# EAGLE design blynk_light_switch_v1 (EAGLE 7.6.0)
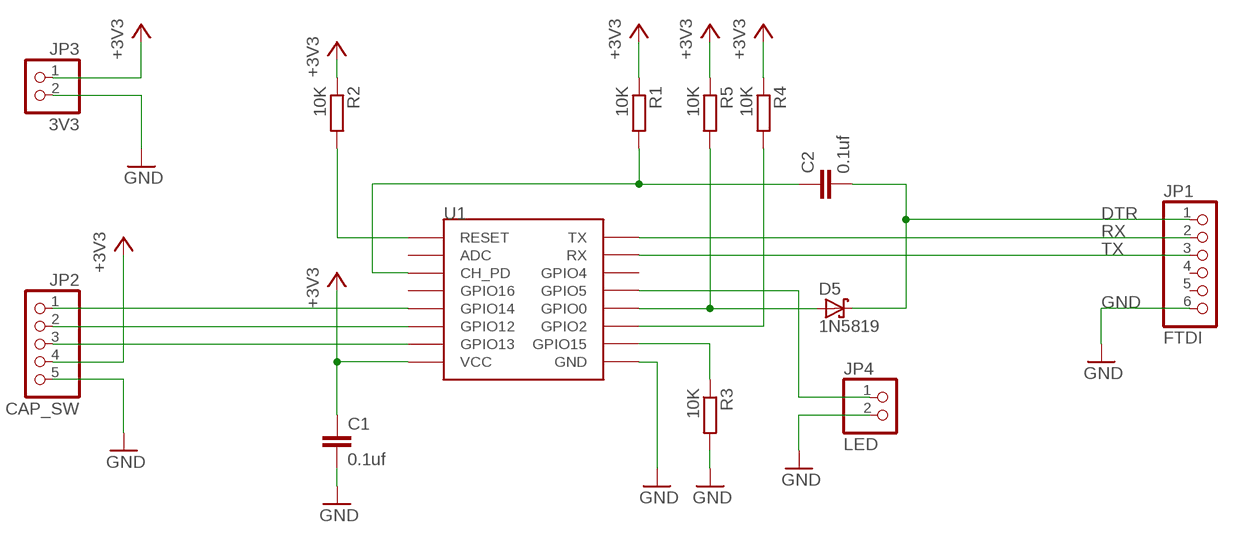
[diagram p0: schematic, sheet 1]

## Parts
C1  0.1uf  C-EUC0805  [C0805]
C2  0.1uf  C-EUC0805  [C0805]
D5  1N5819  SCHOTTKY-DIODECB429-17  [CB429-17]
JP1  FTDI  PINHD-1X6  [1X06]
JP2  CAP_SW  PINHD-1X5  [1X05]
JP3  3V3  PINHD-1X2  [1X02]
JP4  LED  PINHD-1X2  [1X02]
R1  10K  R-EU_R0805  [R0805]
R2  10K  R-EU_R0805  [R0805]
R3  10K  R-EU_R0805  [R0805]
R4  10K  R-EU_R0805  [R0805]
R5  10K  R-EU_R0805  [R0805]
U1  ESP12SMD  [ESP12-SMD]

## Nets
+3V3: C1.1 JP2.4 JP3.1 R1.1 R2.1 R4.1 R5.1 U1.VCC
DTR: C2.2 D5.C JP1.1
GND: C1.2 JP1.6 JP2.5 JP3.2 JP4.2 R3.2 U1.GND
N$1: R2.2 U1.RESET
N$2: C2.1 R1.2 U1.CH_PD
N$4: R4.2 U1.GPIO2
N$5: JP2.1 U1.GPIO14
N$6: D5.A R5.2 U1.GPIO0
N$7: JP2.2 U1.GPIO12
N$8: JP2.3 U1.GPIO13
N$9: R3.1 U1.GPIO15
N$10: JP4.1 U1.GPIO5
RX: JP1.2 U1.TXD0(TX)
TX: JP1.3 U1.RXD0(RX)
Unconnected: JP1.4 JP1.5 U1.ADC U1.GPIO4 U1.GPIO16

## Library data of the parts
C1 C2 = resistor:C-EU: CAPACITOR, European symbol
D5 = diode:SCHOTTKY-DIODE: Schottky Diode
JP1 = adafruit:PINHD-1X6: PIN HEADER; OC_FARNELL: unknown
JP2 = pinhead:PINHD-1X5: PIN HEADER
JP3 JP4 = pinhead:PINHD-1X2: PIN HEADER
R1-R5 = resistor:R-EU_: RESISTOR, European symbol; MF: ARCOL/OHMITE; MPN: MRA0207 100K B 15PPM TA; OC_FARNELL: 2531019
U1 = esp8266modules:ESP12: ESP8266 Wifi module 12; OC_FARNELL: unknown

## Net classes
0 default: width 0.305 mm, drill 0.508 mm, clearance 0.254 mm

## Board
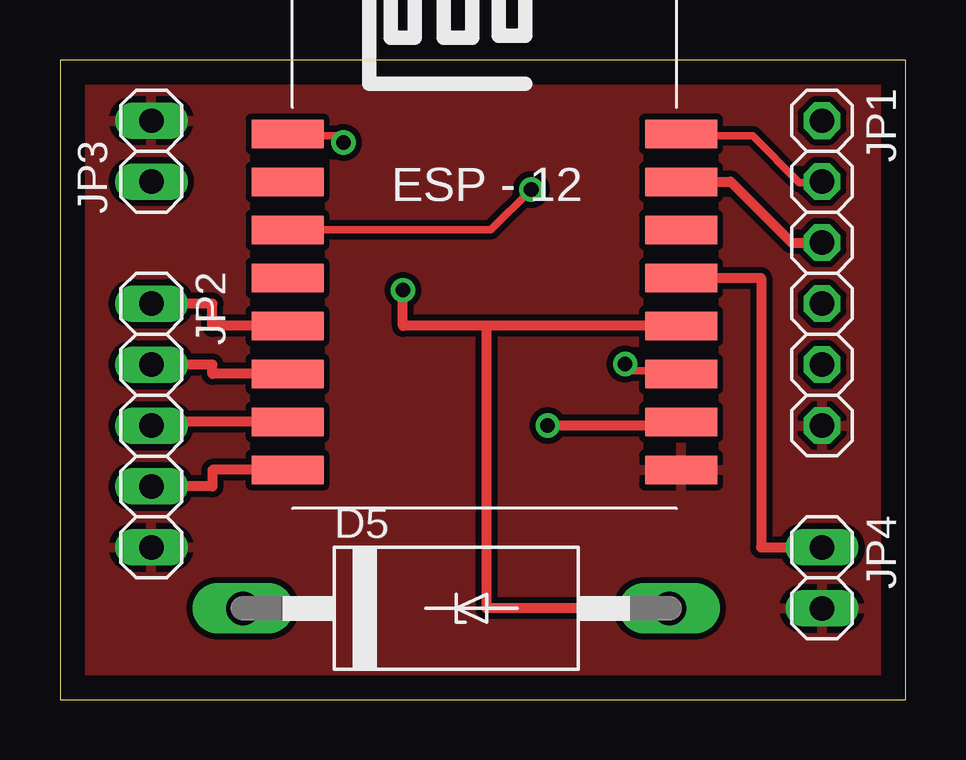
[diagram p1: board, top side]
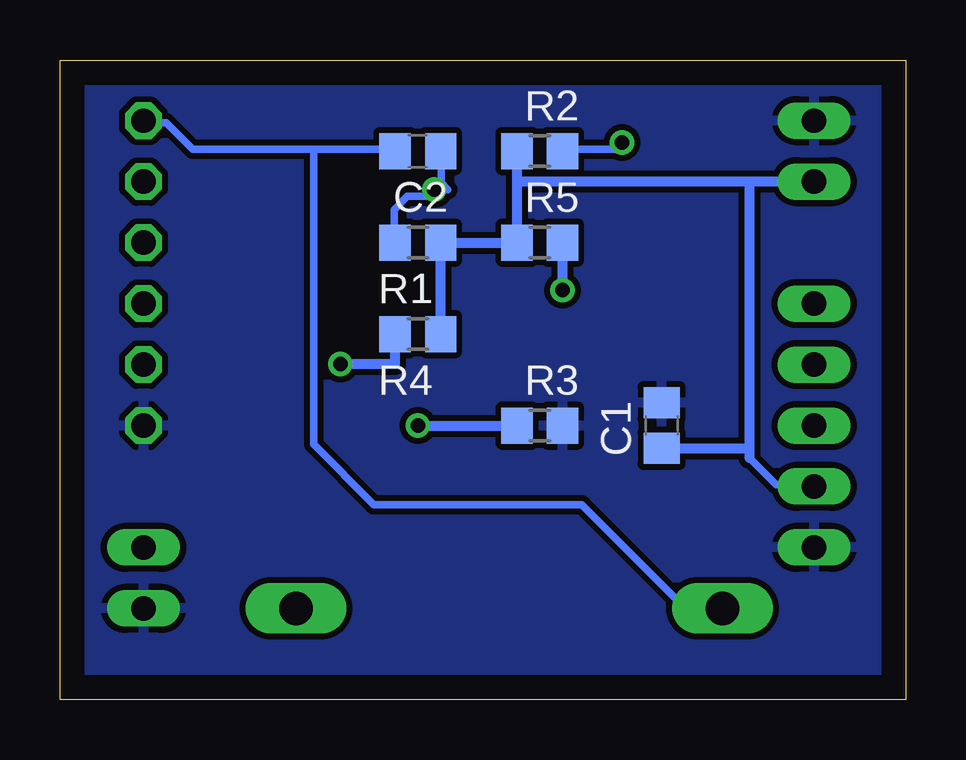
[diagram p2: board, bottom side, seen from below]

Size 35.23 x 26.66 mm. Coordinates in mm from the lower left corner, seen from the top.
Outline: 0,0 35.23,0 35.23,26.66 0,26.66 0,0
Copper layers (1*16): Top 0.035mm / dielectric 1.5mm / Bottom 0.035mm
Design rules "default": minimum track width 10mil, minimum drill 24mil, track to track 8mil, track to pad 8mil, pad to pad 8mil, via to via 8mil, smd to smd 8mil, copper to edge 40mil, drill to drill 8mil, minimum pad ring 10mil, minimum via ring 8mil, stop-mask expansion 4mil, vias tented up to drill 0mil, thermal gap 10mil

### Footprints (pad centres in the part's own frame; a part is rotated, then mirrored left to right if it is on the bottom)
C0805 = smd 1.3 x 1.5: 1 -0.95,0; 2 0.95,0
CB429-17 = drill 1.397 long: A 8.89,0; C -8.89,0
1X06 = drill 1.016 octagon: 1 -6.35,0; 2 -3.81,0; 3 -1.27,0; 4 1.27,0; 5 3.81,0; 6 6.35,0
1X05 = drill 1.016 long: 1 -5.08,0; 2 -2.54,0; 3 0,0; 4 2.54,0; 5 5.08,0
1X02 = drill 1.016 long: 1 -1.27,0; 2 1.27,0
R0805 = smd 1.3 x 1.5: 1 -0.95,0; 2 0.95,0
ESP12-SMD = smd 3 x 1.2: ADC -8.3,3.8; CH_PD -8.3,1.8; GND 8.1,-8.2; GPIO0 8.1,-2.2; GPIO2 8.1,-4.2; GPIO4 8.1,1.8; GPIO5 8.1,-0.2; GPIO12 -8.3,-4.2; GPIO13 -8.3,-6.2; GPIO14 -8.3,-2.2; GPIO15 8.1,-6.2; GPIO16 -8.3,-0.2; RESET -8.3,5.8; RXD0 8.1,3.8; TXD0 8.1,5.8; VCC -8.3,-8.2

### Placement (x,y rotation side)
C1  10.16,11.43 90 bottom
C2  20.32,22.86 180 bottom
D5  16.51,3.81 0 top
JP1  31.75,17.78 270 top
JP2  3.81,11.43 270 top
JP3  3.81,22.86 90 top
JP4  31.75,5.08 270 top
R1  20.32,19.05 180 bottom
R2  15.24,22.86 0 bottom
R3  15.24,11.43 0 bottom
R4  20.32,15.24 180 bottom
R5  15.24,19.05 0 bottom
U1  17.78,17.78 0 top

### Tracks (layer width: path | path; a pad name or v marks a point on that pad's centre or on a via)
+3V3
  Top 0.406: U1.VCC 6.35,9.58 6.35,8.89 JP2.4
  Bottom 0.305: 6.5,10.08 5.38,8.97 3.99,8.97 JP2.4
  Bottom 0.406: JP3.1 6.5,21.59 | 6.5,21.59 6.5,10.48 | R2.1 16.19,21.59 | 16.19,21.59 R5.1 R1.1 R4.1 | C1.1 6.5,10.48 | 6.5,10.48 6.5,10.08 | 6.5,21.59 16.19,21.59
DTR
  Bottom 0.305: 24.66,22.94 29.69,22.94 30.81,24.05 31.65,24.05 JP1.1 | 24.66,22.94 21.31,22.94 C2.2 | 24.66,22.94 24.66,10.64 22.15,8.13 13.49,8.13 9.3,3.94 7.62,3.94 D5.C
GND
  pour Bottom: 0,26.67 0,0 35.56,0 35.56,26.67
  pour Top: 0,26.67 0,0 35.56,0 35.56,26.67
N$1  (via drill 0.61)
  Top 0.305: v11.81,23.22 11.53,23.49 9.58,23.49 U1.RESET
  Bottom 0.305: v11.81,23.22 12.09,22.94 14.05,22.94 R2.2
N$2  (via drill 0.61)
  Top 0.305: v19.63,21.26 17.96,19.58 9.58,19.58 U1.CH_PD
  Bottom 0.305: 19.36,21.54 v19.63,21.26 19.91,20.98 20.75,20.98 21.31,20.42 21.31,19.3 R1.2 | 19.36,21.54 19.36,22.66 C2.1 | 19.36,21.54 19.08,21.26
N$4  (via drill 0.6)
  Top 0.305: v23.55,13.99 23.83,13.72 25.78,13.72 U1.GPIO2
  Bottom 0.406: v23.55,13.99 21.27,13.99 R4.2
N$5
  Top 0.406: U1.GPIO14 6.35,15.58 6.35,16.51 JP2.1
N$6  (via drill 0.6)
  Top 0.406: 25.4,15.24 U1.GPIO0 17.78,15.58 | D5.A 17.78,3.81 17.78,15.58 | 17.78,15.58 14.29,15.58 v14.29,17.07
  Bottom 0.406: v14.29,17.07 R5.2
N$7
  Top 0.406: U1.GPIO12 6.35,13.58 6.35,13.97 JP2.2
N$8
  Top 0.406: U1.GPIO13 3.81,11.58 JP2.3
N$9  (via drill 0.6)
  Top 0.406: U1.GPIO15 25.4,11.43 v20.32,11.43
  Bottom 0.406: v20.32,11.43 R3.1
N$10
  Top 0.406: U1.GPIO5 29.21,17.58 29.21,6.35 JP4.1
RX
  Top 0.305: U1.TXD0 26.06,23.49 28.85,23.49 30.81,21.54 31.65,21.54 JP1.2
TX
  Top 0.406: U1.RXD0 27.94,21.59 30.48,19.05 JP1.3